# EasyEDA Pro project Batterytester.epro, schematic Schematic1
Board Name: Board1; Create Date: 2025-07-15; Page Name: P1; Project Name: @trent81; Schematic Name: Schematic1; Update Date: 2025-07-21; Company: EasyEDA.com; Page Size: A4; Version: V1.0
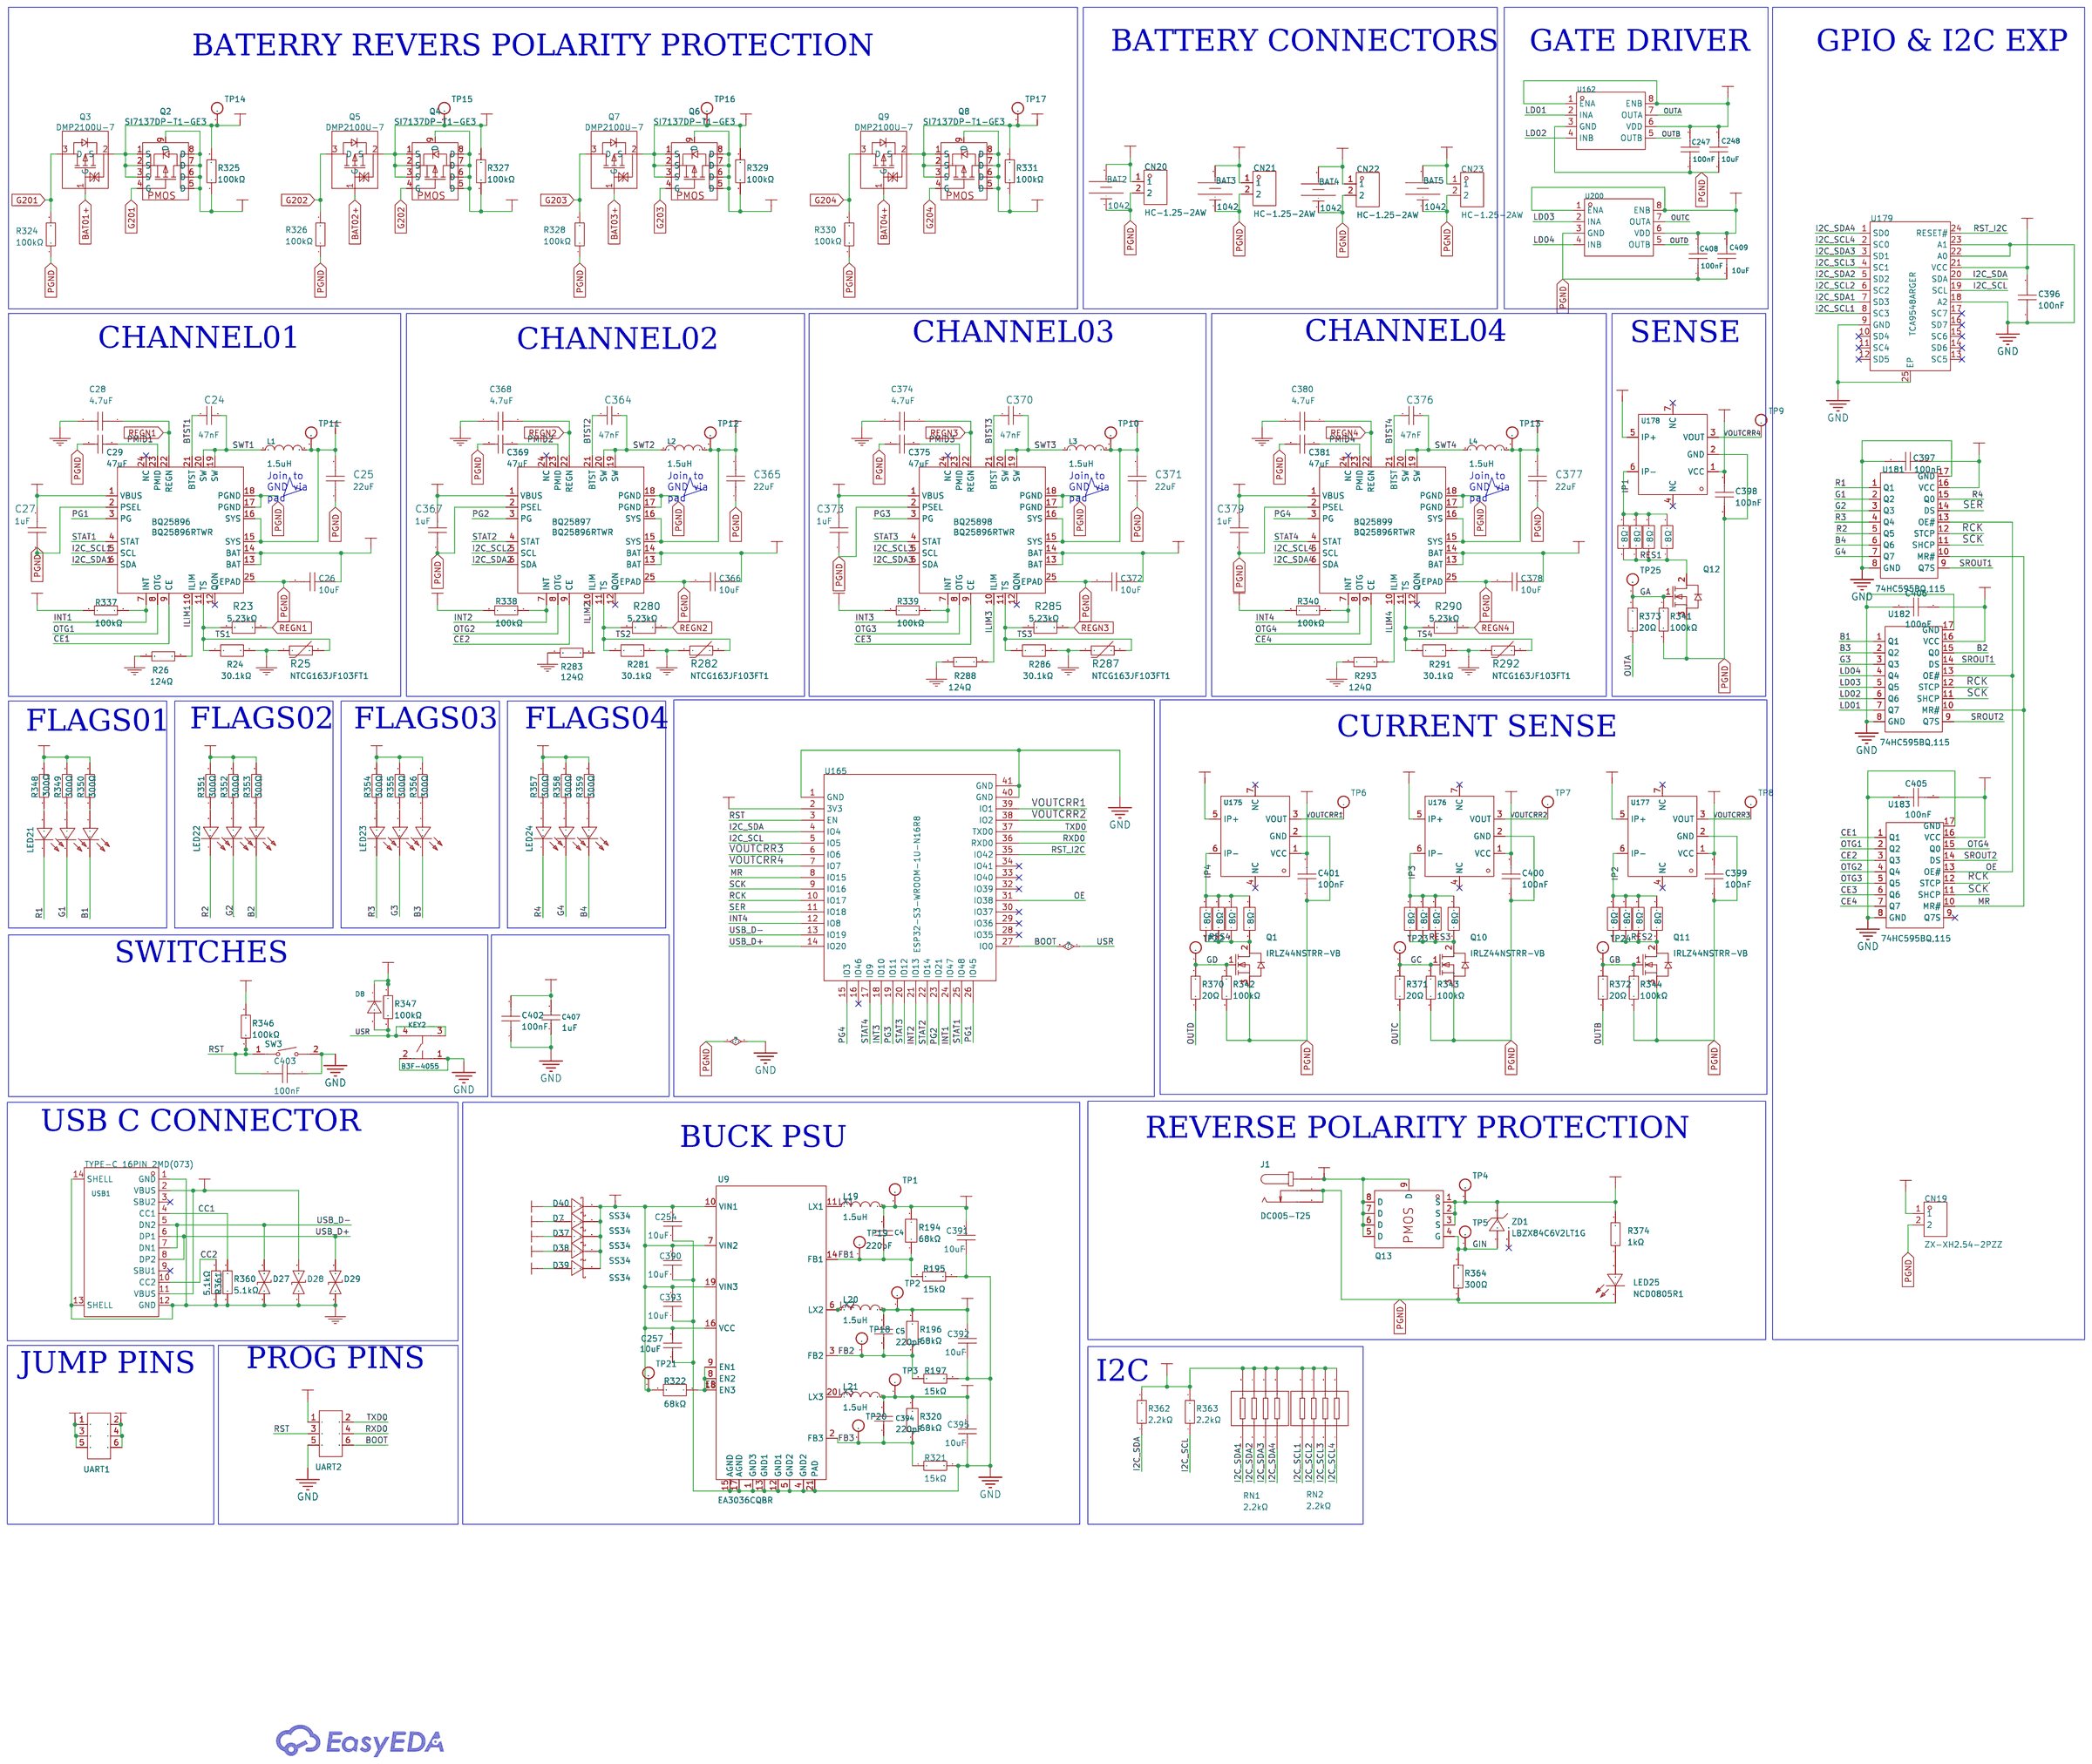
[diagram p0: schematic sheet]

## Parts
BAT2  1042  [BAT-SMD_1042P]
BAT3  1042  [BAT-SMD_1042P]
BAT4  1042  [BAT-SMD_1042P]
BAT5  1042  [BAT-SMD_1042P]
BQ25896  BQ25896RTWR  [QFN-24_L4.0-W4.0-P0.50-TL-EP2.7]
BQ25897  BQ25896RTWR  [QFN-24_L4.0-W4.0-P0.50-TL-EP2.7]
BQ25898  BQ25896RTWR  [QFN-24_L4.0-W4.0-P0.50-TL-EP2.7]
BQ25899  BQ25896RTWR  [QFN-24_L4.0-W4.0-P0.50-TL-EP2.7]
C4  220pF  [C1206]
C5  220pF  [C1206]
C24  47nF  [C0603]
C25  22uF  [C0603]
C26  10uF  [C0603]
C27  1uF  [C0603]
C28  4.7uF  [C0603]
C29  47uF  [C0805]
C247  100nF  [C1210]
C248  10uF  [C1210]
C254  10uF  [C1206]
C257  10uF  [C1206]
C364  47nF  [C0603]
C365  22uF  [C0603]
C366  10uF  [C0603]
C367  1uF  [C0603]
C368  4.7uF  [C0603]
C369  47uF  [C0805]
C370  47nF  [C0603]
C371  22uF  [C0603]
C372  10uF  [C0603]
C373  1uF  [C0603]
C374  4.7uF  [C0603]
C375  47uF  [C0805]
C376  47nF  [C0603]
C377  22uF  [C0603]
C378  10uF  [C0603]
C379  1uF  [C0603]
C380  4.7uF  [C0603]
C381  47uF  [C0805]
C390  10uF  [C1206]
C391  10uF  [C1206]
C392  10uF  [C1206]
C393  10uF  [C1206]
C394  220pF  [C1206]
C395  10uF  [C1206]
C396  100nF  [C0805]
C397  100nF  [C0805]
C398  100nF  [C0805]
C399  100nF  [C0805]
C400  100nF  [C0805]
C401  100nF  [C0805]
C402  100nF  [C0805]
C403  100nF  [C0805]
C405  100nF  [C0805]
C406  100nF  [C0805]
C407  1uF  [C0805]
C408  100nF  [C1210]
C409  10uF  [C1210]
CN19  ZX-XH2.54-2PZZ  [CONN-TH_2P-P2.50_HX25003-2A]
CN20  HC-1.25-2AW  [CONN-TH_2P-P1.25_HCTL_HC-1.25-2AW]
CN21  HC-1.25-2AW  [CONN-TH_2P-P1.25_HCTL_HC-1.25-2AW]
CN22  HC-1.25-2AW  [CONN-TH_2P-P1.25_HCTL_HC-1.25-2AW]
CN23  HC-1.25-2AW  [CONN-TH_2P-P1.25_HCTL_HC-1.25-2AW]
D7  SS34  [SMA_L4.3-W2.6-LS5.2-RD]
D8  1N4148W-7-F  [SOD-123_L2.7-W1.6-LS3.7-RD-1]
D27  LESD5D5.0CT1G  [SOD-523_L1.2-W0.8-LS1.6-BI]
D28  LESD5D5.0CT1G  [SOD-523_L1.2-W0.8-LS1.6-BI]
D29  LESD5D5.0CT1G  [SOD-523_L1.2-W0.8-LS1.6-BI]
D37  SS34  [SMA_L4.3-W2.6-LS5.2-RD]
D38  SS34  [SMA_L4.3-W2.6-LS5.2-RD]
D39  SS34  [SMA_L4.3-W2.6-LS5.2-RD]
D40  SS34  [SMA_L4.3-W2.6-LS5.2-RD]
J1  DC005-T25  [DC-IN-TH_DC-005-20A-1]
KEY2  B3F-4055  [KEY-TH_4P-L12.0-W12.0-P5.00-LS13.4-EH]
L1  1.5uH  [IND-SMD_L6.5-W6.5_VISHAY]
L2  1.5uH  [IND-SMD_L6.5-W6.5_VISHAY]
L3  1.5uH  [IND-SMD_L6.5-W6.5_VISHAY]
L4  1.5uH  [IND-SMD_L6.5-W6.5_VISHAY]
L19  1.5uH  [IND-SMD_L4.4-W4.2]
L20  1.5uH  [IND-SMD_L4.4-W4.2]
L21  1.5uH  [IND-SMD_L4.4-W4.2]
LED21  HL-AF-5060H271BU46FU79GC-S1-THL  [LED-ARRAY-SMD_6P-L5.4-W5.0-TL-FD]
LED22  HL-AF-5060H271BU46FU79GC-S1-THL  [LED-ARRAY-SMD_6P-L5.4-W5.0-TL-FD]
LED23  HL-AF-5060H271BU46FU79GC-S1-THL  [LED-ARRAY-SMD_6P-L5.4-W5.0-TL-FD]
LED24  HL-AF-5060H271BU46FU79GC-S1-THL  [LED-ARRAY-SMD_6P-L5.4-W5.0-TL-FD]
LED25  NCD0805R1  [LED0805-R-RD]
Q1  IRLZ44NSTRR-VB  [TO-263-3_L10.2-W9.2-P5.08-LS15.4-BR]
Q2  SI7137DP-T1-GE3  [DFN-8_L5.1-W5.7-P1.27-LS6.1-BL]
Q3  DMP2100U-7  [SOT-23_L2.9-W1.3-P1.90-LS2.4-BR]
Q4  SI7137DP-T1-GE3  [DFN-8_L5.1-W5.7-P1.27-LS6.1-BL]
Q5  DMP2100U-7  [SOT-23_L2.9-W1.3-P1.90-LS2.4-BR]
Q6  SI7137DP-T1-GE3  [DFN-8_L5.1-W5.7-P1.27-LS6.1-BL]
Q7  DMP2100U-7  [SOT-23_L2.9-W1.3-P1.90-LS2.4-BR]
Q8  SI7137DP-T1-GE3  [DFN-8_L5.1-W5.7-P1.27-LS6.1-BL]
Q9  DMP2100U-7  [SOT-23_L2.9-W1.3-P1.90-LS2.4-BR]
Q10  IRLZ44NSTRR-VB  [TO-263-3_L10.2-W9.2-P5.08-LS15.4-BR]
Q11  IRLZ44NSTRR-VB  [TO-263-3_L10.2-W9.2-P5.08-LS15.4-BR]
Q12  IRLZ44NSTRR-VB  [TO-263-3_L10.2-W9.2-P5.08-LS15.4-BR]
Q13  SI7137DP-T1-GE3  [DFN-8_L5.1-W5.7-P1.27-LS6.1-BL]
R23  5.23kΩ  [R0603]
R24  30.1kΩ  [R0603]
R25  NTCG163JF103FT1  [R0603]
R26  124Ω  [R0603]
R194  68kΩ  [R1206]
R195  15kΩ  [R1206]
R196  68kΩ  [R1206]
R197  15kΩ  [R1206]
R280  5.23kΩ  [R0603]
R281  30.1kΩ  [R0603]
R282  NTCG163JF103FT1  [R0603]
R283  124Ω  [R0603]
R285  5.23kΩ  [R0603]
R286  30.1kΩ  [R0603]
R287  NTCG163JF103FT1  [R0603]
R288  124Ω  [R0603]
R290  5.23kΩ  [R0603]
R291  30.1kΩ  [R0603]
R292  NTCG163JF103FT1  [R0603]
R293  124Ω  [R0603]
R320  68kΩ  [R1206]
R321  15kΩ  [R1206]
R322  68kΩ  [R1206]
R324  100kΩ  [R0805]
R325  100kΩ  [R0805]
R326  100kΩ  [R0805]
R327  100kΩ  [R0805]
R328  100kΩ  [R0805]
R329  100kΩ  [R0805]
R330  100kΩ  [R0805]
R331  100kΩ  [R0805]
R337  100kΩ  [R0805]
R338  100kΩ  [R0805]
R339  100kΩ  [R0805]
R340  100kΩ  [R0805]
R341  100kΩ  [R0805]
R342  100kΩ  [R0805]
R343  100kΩ  [R0805]
R344  100kΩ  [R0805]
R346  100kΩ  [R0805]
R347  100kΩ  [R0805]
R348  300Ω  [R0805]
R349  300Ω  [R0805]
R350  300Ω  [R0805]
R351  300Ω  [R0805]
R352  300Ω  [R0805]
R353  300Ω  [R0805]
R354  300Ω  [R0805]
R355  300Ω  [R0805]
R356  300Ω  [R0805]
R357  300Ω  [R0805]
R358  300Ω  [R0805]
R359  300Ω  [R0805]
R360  5.1kΩ  [R0805]
R361  5.1kΩ  [R0805]
R362  2.2kΩ  [R0805]
R363  2.2kΩ  [R0805]
R364  300Ω  [R0805]
R370  20Ω  [R1206]
R371  20Ω  [R1206]
R372  20Ω  [R1206]
R373  20Ω  [R1206]
R374  1kΩ  [R0805]
RN1  2.2kΩ  [RES-ARRAY-SMD_0603-8P-L3.2-W1.6-BL]
RN2  2.2kΩ  [RES-ARRAY-SMD_0603-8P-L3.2-W1.6-BL]
SW3  TS-3025-B-C-B  [SW-SMD_L3.0-W2.5-P3.40-LS4.0-L]
TP1  -  [TESTPOINT-SMD_BD2.0-H10.5]
TP2  -  [TESTPOINT-SMD_BD2.0-H10.5]
TP3  -  [TESTPOINT-SMD_BD2.0-H10.5]
TP4  -  [TESTPOINT-SMD_BD2.0-H10.5]
TP5  -  [TESTPOINT-SMD_BD2.0-H10.5]
TP6  -  [TESTPOINT-SMD_BD2.0-H10.5]
TP7  -  [TESTPOINT-SMD_BD2.0-H10.5]
TP8  -  [TESTPOINT-SMD_BD2.0-H10.5]
TP9  -  [TESTPOINT-SMD_BD2.0-H10.5]
TP10  -  [TESTPOINT-SMD_BD2.0-H10.5]
TP11  -  [TESTPOINT-SMD_BD2.0-H10.5]
TP12  -  [TESTPOINT-SMD_BD2.0-H10.5]
TP13  -  [TESTPOINT-SMD_BD2.0-H10.5]
TP14  -  [TESTPOINT-SMD_BD2.0-H10.5]
TP15  -  [TESTPOINT-SMD_BD2.0-H10.5]
TP16  -  [TESTPOINT-SMD_BD2.0-H10.5]
TP17  -  [TESTPOINT-SMD_BD2.0-H10.5]
TP18  -  [TESTPOINT-SMD_BD2.0-H10.5]
TP19  -  [TESTPOINT-SMD_BD2.0-H10.5]
TP20  -  [TESTPOINT-SMD_BD2.0-H10.5]
TP21  -  [TESTPOINT-SMD_BD2.0-H10.5]
TP22  -  [TESTPOINT-SMD_BD2.0-H10.5]
TP23  -  [TESTPOINT-SMD_BD2.0-H10.5]
TP24  -  [TESTPOINT-SMD_BD2.0-H10.5]
TP25  -  [TESTPOINT-SMD_BD2.0-H10.5]
U9  EA3036CQBR  [WQFN-20_L3.0-W3.0-P0.40-BL-EP]
U162  UCC27524ADR  [SOIC-8_L4.9-W3.9-P1.27-LS6.0-BL]
U165  ESP32-S3-WROOM-1U-N16R8  [WIRELM-SMD_ESP32-S3-WROOM-1U]
U175  ACS781LLRTR-100B-T  [PSOF-7_L6.4-W4.8-BL]
U176  ACS781LLRTR-100B-T  [PSOF-7_L6.4-W4.8-BL]
U177  ACS781LLRTR-100B-T  [PSOF-7_L6.4-W4.8-BL]
U178  ACS781LLRTR-100B-T  [PSOF-7_L6.4-W4.8-BL]
U179  TCA9548ARGER  [VQFN-24_L4.0-W4.0-P0.50-BL-EP2.5]
U181  74HC595BQ,115  [DHVQFN-16_L3.5-W2.5-P0.50-BL-EP]
U182  74HC595BQ,115  [DHVQFN-16_L3.5-W2.5-P0.50-BL-EP]
U183  74HC595BQ,115  [DHVQFN-16_L3.5-W2.5-P0.50-BL-EP]
U184  8Ω  [R1225]
U185  8Ω  [R1225]
U186  8Ω  [R1225]
U187  8Ω  [R1225]
U188  8Ω  [R1225]
U189  8Ω  [R1225]
U190  8Ω  [R1225]
U191  8Ω  [R1225]
U192  8Ω  [R1225]
U193  8Ω  [R1225]
U194  8Ω  [R1225]
U195  8Ω  [R1225]
U196  8Ω  [R1225]
U197  8Ω  [R1225]
U198  8Ω  [R1225]
U199  8Ω  [R1225]
U200  UCC27524ADR  [SOIC-8_L4.9-W3.9-P1.27-LS6.0-BL]
UART1  20021121-00006C4LF  [HDR-SMD_6P-P1.27-V-M-R2-C3-S1.27-LS5.5]
UART2  20021121-00006C4LF  [HDR-SMD_6P-P1.27-V-M-R2-C3-S1.27-LS5.5]
USB1  TYPE-C 16PIN 2MD(073)  [USB-C-SMD_TYPE-C-6PIN-2MD-073]
ZD1  LBZX84C6V2LT1G  [SOT-23-3_L2.9-W1.6-P1.90-LS2.8-BR]

## Library data of the parts
BAT2-BAT5 = 1042: Supplier Part: C5249310; Manufacturer: Keystone; JLCPCB Part Class: Extended Part; Datasheet: https://atta.szlcsc.com/upload/public/pdf/source/20220613/E20FB676785C04F2B410CFDFE9F9681E.pdf; Supplier: LCSC
BQ25896-BQ25899 = BQ25896RTWR: Supplier: LCSC; Supplier Part: C181475; Manufacturer: Texas Instruments; JLCPCB Part Class: Extended Part
C4 C5 C394 = CC1206KKX7RCBB221: Capacitance: Tolerance:±10% Tolerance:±10% Voltage Rated: Temperature Coefficient:; LCSC Part Name: 220pF ±10% 1kV; Supplier Part: C107193; Manufacturer: YAGEO(国巨); Supplier Footprint: 1206; JLCPCB Part Class: Extended Part; Datasheet: https://atta.szlcsc.com/upload/public/pdf/source/20180910/C282080_BCE296114B59C3710FB69343383A5C6E.pdf; Supplier: LCSC; Tolerance: ±10%
C24 C364 C370 C376 = CL10B473JB8NNNC: Capacitance: Tolerance:±5% Tolerance:±5% Voltage Rated: Temperature Coefficient:; LCSC Part Name: 47nF ±5% 50V; Supplier Part: C444880; Manufacturer: SAMSUNG(三星); Supplier Footprint: 0603; JLCPCB Part Class: Extended Part; Datasheet: https://atta.szlcsc.com/upload/public/pdf/source/20191106/C444885_D1DE823F0ED498E02883F0194C396E9C.pdf; Supplier: LCSC; Tolerance: ±5%
C25 C365 C371 C377 = GRM188R61A226ME15D: Capacitance: Tolerance:±20% Tolerance:±20% Voltage Rated: Temperature Coefficient:; LCSC Part Name: 22uF ±20% 10V; Supplier Part: C84419; Manufacturer: muRata(村田); Supplier Footprint: 0603; JLCPCB Part Class: Extended Part; Datasheet: https://atta.szlcsc.com/upload/public/pdf/source/20161024/1477288637384.pdf; Supplier: LCSC; Tolerance: ±20%
C26 C366 C372 C378 = GRM188Z71A106KA73D: Capacitance: Tolerance:±10% Tolerance:±10% Voltage Rated: Temperature Coefficient:; LCSC Part Name: 10uF ±10% 10V; Supplier Part: C2959727; Manufacturer: muRata(村田); Supplier Footprint: 0603; JLCPCB Part Class: Extended Part; Datasheet: https://atta.szlcsc.com/upload/public/pdf/source/20220328/6A4892B7E841253269A84FFE395E0578.pdf; Supplier: LCSC; Tolerance: ±10%
C27 C367 C373 C379 = CGA3E1X7R1V105KT000N: Capacitance: Tolerance:±10% Tolerance:±10% Voltage Rated: Temperature Coefficient:; LCSC Part Name: 1uF ±10% 35V; Supplier Part: C342956; Manufacturer: TDK; Supplier Footprint: 0603; JLCPCB Part Class: Extended Part; Datasheet: https://atta.szlcsc.com/upload/public/pdf/source/20190410/C342987_3963516CFC6D3522CA0E150D06ECDE07.pdf; Supplier: LCSC; Tolerance: ±10%
C28 C368 C374 C380 = GRM188Z71C475KE21D: Capacitance: Tolerance:±10% Tolerance:±10% Voltage Rated: Temperature Coefficient:; LCSC Part Name: 4.7uF ±10% 16V; Supplier Part: C389010; Manufacturer: muRata(村田); Supplier Footprint: 0603; JLCPCB Part Class: Extended Part; Datasheet: https://atta.szlcsc.com/upload/public/pdf/source/20190418/C389010_378994D96815F6C3A9D8A85630794D48.pdf; Supplier: LCSC; Tolerance: ±10%
C29 C369 C375 C381 = C2012X5R1A476MTJ00E: Capacitance: Tolerance:±20% Tolerance:±20% Voltage Rated: Temperature Coefficient:; LCSC Part Name: 47uF ±20% 10V; Supplier Part: C76636; Manufacturer: TDK; Supplier Footprint: 0805; JLCPCB Part Class: Extended Part; Datasheet: https://atta.szlcsc.com/upload/public/pdf/source/20230606/A83975C7E70EF5AFCD4A17254ABD78F2.pdf; Supplier: LCSC; Tolerance: ±20%
C247 C408 = 1210B104K631NT: Capacitance:100nF Tolerance:±10% Tolerance:±10% Voltage Rating:630V Temperature Coefficient:X7R; LCSC Part Name: 100nF ±10% 630V; Supplier Part: C1322392; Manufacturer: FH(风华); Supplier Footprint: 1210; JLCPCB Part Class: Extended Part; Datasheet: https://atta.szlcsc.com/upload/public/pdf/source/20200305/C486355_26A10D38EF8C2A5C37091D0039909270.pdf; Supplier: LCSC; Tolerance: ±10%; Voltage Rating: 630V; Temperature Coefficient: X7R
C248 C409 = CL32B106KBJNNNE: Capacitance: Tolerance:±10% Tolerance:±10% Voltage Rated: Temperature Coefficient:; LCSC Part Name: 10uF ±10% 50V; Supplier Part: C138687; Manufacturer: SAMSUNG(三星); Supplier Footprint: 1210; JLCPCB Part Class: Extended Part; Datasheet: https://atta.szlcsc.com/upload/public/pdf/source/20190426/C138687_F326FA7378191C6A10A83DC717674AAD.pdf; Supplier: LCSC; Tolerance: ±10%
C254 C257 C390-C393 C395 = CL31A106KBHNNNE: Capacitance: Tolerance:±10% Tolerance:±10% Voltage Rated: Temperature Coefficient:; LCSC Part Name: 10uF ±10% 50V; Supplier Part: C13585; Manufacturer: SAMSUNG(三星); Supplier Footprint: 1206; JLCPCB Part Class: Basic Part; Datasheet: https://atta.szlcsc.com/upload/public/pdf/source/20160218/1457707763339.pdf; Supplier: LCSC; Tolerance: ±10%
C396-C403 C405 C406 = CC0805KRX7R9BB104: Capacitance: Tolerance:±10% Tolerance:±10% Voltage Rated: Temperature Coefficient:; LCSC Part Name: 100nF ±10% 50V; Supplier Part: C49678; Manufacturer: YAGEO(国巨); Supplier Footprint: 0805; JLCPCB Part Class: Basic Part; Datasheet: https://atta.szlcsc.com/upload/public/pdf/source/20180224/C181747_15194369449651363981.pdf; Supplier: LCSC; Tolerance: ±10%
C407 = CL21B105KBFNNNE: Capacitance: Tolerance:±10% Tolerance:±10% Voltage Rated: Temperature Coefficient:; LCSC Part Name: 1uF ±10% 50V; Supplier Part: C28323; Manufacturer: SAMSUNG(三星); Supplier Footprint: 0805; JLCPCB Part Class: Basic Part; Datasheet: https://atta.szlcsc.com/upload/public/pdf/source/20160218/1457707763339.pdf; Supplier: LCSC; Tolerance: ±10%
CN19 = ZX-XH2.54-2PZZ: Pins Structure:1x2P Pitch:2.54mm Mounting Style:Straight Reference Series:XH Number of Pins:2P Number of Rows:1 Number of PINs Per Row:2 Row Spacing:- Current Rating (Max):3A Contact Material:Brass Contact Plating:Tin Operating Temperature Range:-25℃~+85℃; Supplier Part: C7429632; Manufacturer: Megastar(兆星); Supplier Footprint: 插件,P=2.54mm; JLCPCB Part Class: Extended Part; Datasheet: https://atta.szlcsc.com/upload/public/pdf/source/20230619/19BA6947230AA44A04D3EDD65E618FD0.pdf; Supplier: LCSC; Pins Structure: 1x2P; Pitch: 2.54mm; Mounting Style: Straight; Reference Series: XH; Number of Pins: 2P; Number of Rows: 1; Number of PINs Per Row: 2; Current Rating (Max): 3A; Contact Material: Brass; Contact Plating: Tin; Operating Temperature Range: -25℃~+85℃
CN20-CN23 = HC-1.25-2AW: Pins Structure:1x2P Pitch:1.25mm Mounting Style:Bend insert Reference Series:PicoBlade(MX 1.25) Number of Pins:2P Number of Rows:1 Number of PINs Per Row:2 Row Spacing:- Current Rating (Max):1A Contact Material:Brass Contact Plating:Tin Operating Temperat; LCSC Part Name: 1x2P 间距:1.25mm 弯插 系列:PicoBlade(MX 1.25); Supplier Part: C2845535; Manufacturer: HCTL(华灿天禄); Supplier Footprint: 弯插,P=1.25mm; JLCPCB Part Class: Extended Part; Datasheet: https://atta.szlcsc.com/upload/public/pdf/source/20230707/04F6BEA69F699E7BB6558EF06AF1DC24.pdf; Supplier: LCSC; Pins Structure: 1x2P; Pitch: 1.25mm; Mounting Style: Bend insert; Reference Series: PicoBlade(MX 1.25); Number of Pins: 2P; Number of Rows: 1; Number of PINs Per Row: 2; Current Rating (Max): 1A; Contact Material: Brass; Contact Plating: Tin; Operating Temperature Range: -25℃~+85℃; Rated Voltage (Max): 125V; Plastic Material: PA46; Flame Retardant Rating: UL94V-0; Z-Height of the Board: 3.2mm; X-Length of Bottom Edge on Board (Spacing Line): 4.25mm; Y-Width of Bottom Edge on Board: 4.7mm
D7 D37-D40 = SS34_C8678: Diode Configuration:Independent Type Forward Voltage (Vf@If):550mV@3A Reverse Voltage (Vr):40V Rectified Current:3A Reverse Leakage Current (Ir):500uA@40V; LCSC Part Name: 电压:40V 电流:3A; Supplier Part: C8678; Manufacturer: MDD(辰达半导体); Supplier Footprint: SMA(DO-214AC); JLCPCB Part Class: Basic Part; Datasheet: https://atta.szlcsc.com/upload/public/pdf/source/20240710/2118BB86FDDB2E0B294389AC1F3F65C8.pdf; Supplier: LCSC; Diode Configuration: Independent Type; Forward Voltage (Vf@If): 550mV@3A; Reverse Voltage (Vr): 40V; Rectified Current: 3A; Reverse Leakage Current (Ir): 500uA@40V
D8 = 1N4148W-7-F: Diode Configuration: Forward Voltage (Vf@If):1.25V@150mA Reverse Voltage (Vr): Average Rectified Current (Io): Power Dissipation: Reverse Leakage Current:1uA@75V Reverse Recovery Time (trr): Operating Temperature:-65℃~+150℃@(Tj) Operating Temperature:-65℃; LCSC Part Name: 电压:100V 电流:300mA; Supplier Part: C83528; Manufacturer: DIODES(美台); Supplier Footprint: SOD-123; JLCPCB Part Class: Extended Part; Datasheet: https://atta.szlcsc.com/upload/public/pdf/source/20161024/1477288538619.pdf; Supplier: LCSC; Forward Voltage (Vf@If): 1.25V@150mA; Reverse Leakage Current: 1uA@75V; Operating Temperature: -65℃~+150℃@(Tj)
D27-D29 = LESD5D5.0CT1G_C41399463: LCSC Part Name: 双向 5V截止 7A峰值脉冲; Supplier Part: C41399463; Manufacturer: GOODWORK(固得沃克); Supplier Footprint: SOD-523; Datasheet: https://atta.szlcsc.com/upload/public/pdf/source/20240930/3DBB69F9DFF750B46374C05084BE62EF.pdf; Supplier: LCSC
J1 = DC005-T25: Connector Type:DC Power Receptacle Mounting Type:Bend-in Inside Contact Diameter:2.5mm Outside Contact Diameter:6.3mm Current Rating:3A Voltage Rating (Max):12V Operating Temperature:-10℃~+60℃ Operating Temperature:-10℃~+60℃; LCSC Part Name: DC电源插座 内径:2.5mm 外径:6.3mm; Supplier Part: C111573; Manufacturer: SOFNG(硕方); Supplier Footprint: 插件; JLCPCB Part Class: Extended Part; Datasheet: https://atta.szlcsc.com/upload/public/pdf/source/20211217/AAF92010038535095742900872F779AE.pdf; Supplier: LCSC; Connector Type: DC Power Receptacle; Mounting Type: Bend-in; Inside Contact Diameter: 2.5mm; Outside Contact Diameter: 6.3mm; Current Rating: 3A; Voltage Rating (Max): 12V; Operating Temperature: -10℃~+60℃
KEY2 = B3F-4055_C84931: Circuit:SPST Actuator Style:Rectangle button Mounting Style:Direct Insert Switch Length:12mm Switch Width:12mm Switch Height:7.3mm Contact Current:50mA Voltage Rating (DC):24V With Lamp:- Mechanical Life:-; LCSC Part Name: 12*12*7.3mm 直插 轻触开关; Supplier Part: C84931; Manufacturer: OMRON(欧姆龙); Supplier Footprint: 插件; JLCPCB Part Class: Extended Part; Datasheet: https://atta.szlcsc.com/upload/public/pdf/source/20170810/C93157_1502335414592880008.pdf; Supplier: LCSC; Circuit: SPST; Actuator Style: Rectangle button; Mounting Style: Direct Insert; Switch Length: 12mm; Switch Width: 12mm; Switch Height: 7.3mm; Contact Current: 50mA; Voltage Rating (DC): 24V
L1-L4 = IHLP2525CZER1R5M01: Inductance: Tolerance:±20% Tolerance:±20% Rated Current: Saturation Current (Isat):18A DC Resistance (DCR): Ratings:-; LCSC Part Name: 1.5uH ±20% 18A; Supplier Part: C845020; Manufacturer: VISHAY(威世); Supplier Footprint: SMD,6.5x6.9mm; JLCPCB Part Class: Extended Part; Datasheet: https://atta.szlcsc.com/upload/public/pdf/source/20211116/476D9E4F649FFADE3C992F1E036BD265.pdf; Supplier: LCSC; Tolerance: ±20%; Saturation Current (Isat): 18A
L19-L21 = FXL0420-1R5-M: Inductance: Tolerance:±20% Tolerance:±20% Rated Current: Saturation Current (Isat):6A DC Resistance (DCR): Type:Integrated molded inductor; LCSC Part Name: 1.5uH ±20% 6A; Supplier Part: C167205; Manufacturer: cjiang(长江微电); Supplier Footprint: SMD,4.2x4.4mm; JLCPCB Part Class: Extended Part; Datasheet: https://atta.szlcsc.com/upload/public/pdf/source/20240426/3189EA8206330E2108542F9E34E540E7.pdf; Supplier: LCSC; Tolerance: ±20%; Saturation Current (Isat): 6A; Type: Integrated molded inductor
LED21-LED24 = HL-AF-5060H271BU46FU79GC-S1-THL: Supplier Part: C219409; Manufacturer: HONGLITRONIC(鸿利光电); Supplier Footprint: SMD5050; JLCPCB Part Class: Extended Part; Datasheet: https://atta.szlcsc.com/upload/public/pdf/source/20180503/C219409_0CFE42153F672A4C05B1C40D14E85291.pdf; Supplier: LCSC
LED25 = NCD0805R1_C84256: Lamp Holder Type:- Emitted Color:Red Forward Voltage (VF):1.6V~2.6V Forward Voltage (VF):1.6V~2.6V Power Dissipation:65mW Forward Current:20mA Dominant Wavelength:615nm~630nm Dominant Wavelength:615nm~630nm Peak Wavelength:- Diode Configuration:独立二极管 Lens; Supplier Part: C84256; Manufacturer: 国星光电; Supplier Footprint: 0805; JLCPCB Part Class: Basic Part; Datasheet: https://atta.szlcsc.com/upload/public/pdf/source/20200820/C84256_F0A75A43B3EAD75808600A0514C76B99.pdf; Supplier: LCSC; Emitted Color: Red; Forward Voltage (VF): 1.6V~2.6V; Power Dissipation: 65mW; Forward Current: 20mA; Dominant Wavelength: 615nm~630nm; Diode Configuration: 独立二极管; Lens Color: 无色透明透镜; Luminous Intensity: 67mcd~195mcd; Viewing Angle: 130°; Operating Temperature: -30℃~+85℃
Q1 Q10-Q12 = IRLZ44NSTRR-VB: Drain to Source Voltage:60V Current - Continuous Drain(Id): RDS(on):11mΩ@10V,75A Pd - Power Dissipation:136W Gate Threshold Voltage (Vgs(th)@Id):3V Gate Charge(Qg):47nC@10V Input Capacitance(Ciss@Vds):4.3nF@25V Reverse Transfer Capacitance (Crss@Vds):225p; LCSC Part Name: N沟道,电流:75A,耐压:60V; Supplier Part: C2680878; Manufacturer: VBsemi(微碧半导体); Supplier Footprint: TO-263; JLCPCB Part Class: Extended Part; Datasheet: https://atta.szlcsc.com/upload/public/pdf/source/20240814/20B6605BBA769C8470073FCF127173C6.pdf; Supplier: LCSC; Drain to Source Voltage: 60V; RDS(on): 11mΩ@10V,75A; Pd - Power Dissipation: 136W; Gate Threshold Voltage (Vgs(th)@Id): 3V; Gate Charge(Qg): 47nC@10V; Input Capacitance(Ciss@Vds): 4.3nF@25V; Reverse Transfer Capacitance (Crss@Vds): 225pF@25V; Operating Temperature: -55℃~+175℃
Q2 Q4 Q6 Q8 = SI7137DP-T1-GE3: Supplier: LCSC; Supplier Part: C784367; Manufacturer: VISHAY(威世); JLCPCB Part Class: Extended Part
Q3 Q5 Q7 Q9 = DMP2100U-7: Supplier: LCSC; Manufacturer: DIODES; Supplier Part: C154867; JLCPCB Part Class: Extended Part
Q13 = SI7137DP-T1-GE3: Type:1 Piece P-Channel Drain Source Voltage (Vdss):20V Continuous Drain Current (Id): Drain Source On Resistance (RDS(on)@Vgs,Id):0.00195Ω@10V Power Dissipation (Pd): Gate Threshold Voltage (Vgs(th)@Id):500mV@250uA Total Gate Charge (Qg@Vgs):188nC Input C; LCSC Part Name: 1个P沟道 耐压:20V 电流:42A; Supplier Part: C784367; Manufacturer: VISHAY(威世); Supplier Footprint: SOP-8; JLCPCB Part Class: Extended Part; Datasheet: https://atta.szlcsc.com/upload/public/pdf/source/20200917/C784367_90CFBD78C21EC8C65E334872855C2BD0.pdf; Supplier: LCSC; Type: 1 Piece P-Channel; Drain Source Voltage (Vdss): 20V; Drain Source On Resistance (RDS(on)@Vgs,Id): 0.00195Ω@10V; Gate Threshold Voltage (Vgs(th)@Id): 500mV@250uA; Total Gate Charge (Qg@Vgs): 188nC; Input Capacitance (Ciss@Vds): 20000pF; Reverse Transfer Capacitance (Crss@Vds): 390pF; Operating Temperature: -55℃~+150℃
R23 R280 R285 R290 = ERJ3EKF5231V: Type:Thick Film Resistors Resistance:5.23kΩ Tolerance:±1% Tolerance:±1% Power(Watts): Overload Voltage (Max):- Temperature Coefficient:±100ppm/℃ Temperature Coefficient:±100ppm/℃ Operating Temperature Range:-55℃~+155℃ Operating Temperature Range:-55℃~+155; LCSC Part Name: 5.23kΩ ±1% 100mW 厚膜电阻; Supplier Part: C403263; Manufacturer: PANASONIC(松下); Supplier Footprint: 0603; JLCPCB Part Class: Extended Part; Datasheet: https://atta.szlcsc.com/upload/public/pdf/source/20190709/C403410_4AA7B6683950D876CE9308C181828FCD.pdf; Supplier: LCSC; Type: Thick Film Resistors; Tolerance: ±1%; Temperature Coefficient: ±100ppm/℃; Operating Temperature Range: -55℃~+155℃
R24 R281 R286 R291 = CRCW060330K1FKEA: Type:Thick Film Resistors Resistance: Tolerance:±1% Tolerance:±1% Power(Watts): Overload Voltage (Max): Temperature Coefficient:±100ppm/℃ Temperature Coefficient:±100ppm/℃ Operating Temperature Range:-55℃~+155℃ Operating Temperature Range:-55℃~+155℃; LCSC Part Name: 厚膜电阻 30.1kΩ ±1% 100mW; Supplier Part: C844775; Manufacturer: VISHAY(威世); Supplier Footprint: 0603; JLCPCB Part Class: Extended Part; Datasheet: https://atta.szlcsc.com/upload/public/pdf/source/20200922/C242478_0C7172CD6F5C3D507069694ED76193BB.pdf; Supplier: LCSC; Type: Thick Film Resistors; Tolerance: ±1%; Temperature Coefficient: ±100ppm/℃; Operating Temperature Range: -55℃~+155℃
R25 R282 R287 R292 = NTCG163JF103FT1: Resistance @ 25℃: B Constant (25℃/50℃): Resistance Tolerance: B Constant (25℃/75℃):3422K B Constant (25℃/85℃):3435K B Constant (25℃/100℃):3435K Power: B Constant Tolerance: Steady State Current (Max):310uA Operating Temperature:-40℃~+125℃ Operating Temper; LCSC Part Name: 10kΩ 电阻精度:±1% 3380K; Supplier Part: C76589; Manufacturer: TDK; Supplier Footprint: 0603; JLCPCB Part Class: Extended Part; Datasheet: https://atta.szlcsc.com/upload/public/pdf/source/20180420/C189881_93225366783E89160088C2F92B447DFF.pdf; Supplier: LCSC; B Constant (25℃/75℃): 3422K; B Constant (25℃/85℃): 3435K; B Constant (25℃/100℃): 3435K; Steady State Current (Max): 310uA; Operating Temperature: -40℃~+125℃
R26 R283 R288 R293 = RK73H1JTTD1240F: Type:Thick Film Resistors Resistance: Tolerance:±1% Tolerance:±1% Power(Watts): Overload Voltage (Max): Temperature Coefficient:±100ppm/℃ Temperature Coefficient:±100ppm/℃ Operating Temperature Range:-55℃~+155℃ Operating Temperature Range:-55℃~+155℃; LCSC Part Name: 厚膜电阻 124Ω ±1% 125mW; Supplier Part: C317096; Manufacturer: KOA; Supplier Footprint: 0603; JLCPCB Part Class: Extended Part; Datasheet: https://atta.szlcsc.com/upload/public/pdf/source/20190124/C346150_30B9D586AD5A22FDBA3A30D88744B479.pdf; Supplier: LCSC; Type: Thick Film Resistors; Tolerance: ±1%; Temperature Coefficient: ±100ppm/℃; Operating Temperature Range: -55℃~+155℃
R194 R196 R320 R322 = RT1206BRD0768KL: Type:Thin Film Resistor Resistance: Tolerance:±0.1% Tolerance:±0.1% Power(Watts):250mW Overload Voltage (Max): Temperature Coefficient:±25ppm/℃ Temperature Coefficient:±25ppm/℃ Operating Temperature Range:-55℃~+155℃ Operating Temperature Range:-55℃~+155℃; LCSC Part Name: 薄膜电阻 68kΩ ±0.1% 250mW; Supplier Part: C706422; Manufacturer: YAGEO(国巨); Supplier Footprint: 1206; JLCPCB Part Class: Extended Part; Datasheet: https://atta.szlcsc.com/upload/public/pdf/source/20200720/C706422_759B829B0D18A4900E8B43DA140C33CB.pdf; Supplier: LCSC; Type: Thin Film Resistor; Tolerance: ±0.1%; Power(Watts): 250mW; Temperature Coefficient: ±25ppm/℃; Operating Temperature Range: -55℃~+155℃
R195 R197 R321 = AR06BTCV1502: Type:Thin Film Resistor Resistance: Tolerance:±0.1% Tolerance:±0.1% Power(Watts): Overload Voltage (Max): Temperature Coefficient:±25ppm/℃ Temperature Coefficient:±25ppm/℃ Operating Temperature Range:-55℃~+155℃ Operating Temperature Range:-55℃~+155℃; LCSC Part Name: 薄膜电阻 15kΩ ±0.1% 125mW; Supplier Part: C319850; Manufacturer: Viking(光颉); Supplier Footprint: 1206; JLCPCB Part Class: Extended Part; Datasheet: https://atta.szlcsc.com/upload/public/pdf/source/20191129/C465721_10D49275DB41E427863CE9C8D788770A.pdf; Supplier: LCSC; Type: Thin Film Resistor; Tolerance: ±0.1%; Temperature Coefficient: ±25ppm/℃; Operating Temperature Range: -55℃~+155℃
R324-R331 R337-R344 R346 R347 = RT0805BRD07100KL: Type:Thin Film Resistor Resistance: Tolerance:±0.1% Tolerance:±0.1% Power(Watts): Overload Voltage (Max): Temperature Coefficient:±25ppm/℃ Temperature Coefficient:±25ppm/℃ Operating Temperature Range:-55℃~+155℃ Operating Temperature Range:-55℃~+155℃; LCSC Part Name: 薄膜电阻 100kΩ ±0.1% 125mW; Supplier Part: C122537; Manufacturer: YAGEO(国巨); Supplier Footprint: 0805; JLCPCB Part Class: Extended Part; Datasheet: https://atta.szlcsc.com/upload/public/pdf/source/20170721/C122537_1500619325668834091.pdf; Supplier: LCSC; Type: Thin Film Resistor; Tolerance: ±0.1%; Temperature Coefficient: ±25ppm/℃; Operating Temperature Range: -55℃~+155℃
R348-R359 R364 = PTFR0805B300RN9: Type:Thin Film Resistor Resistance:300Ω Tolerance:±0.1% Tolerance:±0.1% Power(Watts):130mW Voltage-Supply(Max):150V Temperature Coefficient:±10ppm/℃ Temperature Coefficient:±10ppm/℃ Operating Temperature:-55℃~+125℃ Operating Temperature:-55℃~+125℃; LCSC Part Name: 薄膜电阻 300Ω ±0.1% 130mW; Supplier Part: C351581; Manufacturer: RESI(开步睿思); Supplier Footprint: 0805; JLCPCB Part Class: Extended Part; Datasheet: https://atta.szlcsc.com/upload/public/pdf/source/20240506/11BDC7478D84177AC2A5326A65B6EB29.pdf; Supplier: LCSC; Type: Thin Film Resistor; Tolerance: ±0.1%; Power(Watts): 130mW; Voltage-Supply(Max): 150V; Temperature Coefficient: ±10ppm/℃; Operating Temperature: -55℃~+125℃
R360 R361 = RT0805BRD075K1L: Type:Thin Film Resistor Resistance: Tolerance:±0.1% Tolerance:±0.1% Power(Watts): Overload Voltage (Max): Temperature Coefficient:±25ppm/℃ Temperature Coefficient:±25ppm/℃ Operating Temperature Range:-55℃~+155℃ Operating Temperature Range:-55℃~+155℃; LCSC Part Name: 薄膜电阻 5.1kΩ ±0.1% 125mW; Supplier Part: C122968; Manufacturer: YAGEO(国巨); Supplier Footprint: 0805; JLCPCB Part Class: Extended Part; Datasheet: https://atta.szlcsc.com/upload/public/pdf/source/20170728/C122968_1501225760866848819.pdf; Supplier: LCSC; Type: Thin Film Resistor; Tolerance: ±0.1%; Temperature Coefficient: ±25ppm/℃; Operating Temperature Range: -55℃~+155℃
R362 R363 = PTFR0805B2K20N9: Type:Thin Film Resistor Resistance:2.2kΩ Tolerance:±0.1% Tolerance:±0.1% Power(Watts):130mW Voltage-Supply(Max):150V Temperature Coefficient:±10ppm/℃ Temperature Coefficient:±10ppm/℃ Operating Temperature:-55℃~+125℃ Operating Temperature:-55℃~+125℃; LCSC Part Name: 薄膜电阻 2.2kΩ ±0.1% 130mW; Supplier Part: C351585; Manufacturer: RESI(开步睿思); Supplier Footprint: 0805; JLCPCB Part Class: Extended Part; Datasheet: https://atta.szlcsc.com/upload/public/pdf/source/20240506/11BDC7478D84177AC2A5326A65B6EB29.pdf; Supplier: LCSC; Type: Thin Film Resistor; Tolerance: ±0.1%; Power(Watts): 130mW; Voltage-Supply(Max): 150V; Temperature Coefficient: ±10ppm/℃; Operating Temperature: -55℃~+125℃
R370-R373 = RC1206FR-0720RL: Type:Thick Film Resistors Resistance: Tolerance:±1% Tolerance:±1% Power(Watts):250mW Overload Voltage (Max): Temperature Coefficient:±100ppm/℃ Temperature Coefficient:±100ppm/℃ Operating Temperature Range:-55℃~+155℃ Operating Temperature Range:-55℃~+155℃; LCSC Part Name: 厚膜电阻 20Ω ±1% 250mW; Supplier Part: C114941; Manufacturer: YAGEO(国巨); Supplier Footprint: 1206; JLCPCB Part Class: Extended Part; Datasheet: https://atta.szlcsc.com/upload/public/pdf/source/20180821/C275644_0D56F95EFF785E7D9A1FEF436B37DA78.pdf; Supplier: LCSC; Type: Thick Film Resistors; Tolerance: ±1%; Power(Watts): 250mW; Temperature Coefficient: ±100ppm/℃; Operating Temperature Range: -55℃~+155℃
R374 = 0805W8F1001T5E: Type:Thick Film Resistors Resistance:1kΩ Tolerance:±1% Tolerance:±1% Power(Watts): Overload Voltage (Max): Temperature Coefficient:±100ppm/℃ Temperature Coefficient:±100ppm/℃ Operating Temperature Range:-55℃~+155℃ Operating Temperature Range:-55℃~+155℃; LCSC Part Name: 1kΩ ±1% 125mW 厚膜电阻; Supplier Part: C17513; Manufacturer: UNI-ROYAL(厚声); Supplier Footprint: 0805; JLCPCB Part Class: Basic Part; Datasheet: https://atta.szlcsc.com/upload/public/pdf/source/20200306/C422600_1E6D84923E4A46A82E41ADD87F860B5C.pdf; Supplier: LCSC; Type: Thick Film Resistors; Tolerance: ±1%; Temperature Coefficient: ±100ppm/℃; Operating Temperature Range: -55℃~+155℃
RN1 RN2 = 4D03WGJ0222T5E: Number of Resistors: Resistance:2.2kΩ Tolerance:±5% Tolerance:±5% Power(Watts): Temperature Coefficient:±200ppm/℃ Temperature Coefficient:±200ppm/℃ Number of Pins:; LCSC Part Name: 2.2kΩ ±5%; Supplier Part: C12001; Manufacturer: UNI-ROYAL(厚声); Supplier Footprint: 0603x4; JLCPCB Part Class: Extended Part; Datasheet: https://atta.szlcsc.com/upload/public/pdf/source/20191224/C474318_2527498AE30E813171187CCD28401A71.pdf; Supplier: LCSC; Tolerance: ±5%; Temperature Coefficient: ±200ppm/℃
SW3 = TS-3025-B-C-B: Circuit:SPST Actuator Style:Round Button Operating Force:160gf Mounting Style:Brick nogging Switch Length:2.5mm Switch Width:3mm Switch Height:1.7mm Strike Gundam:不带 Contact Current:50mA Voltage Rating (DC):12V Insulation Resistance:- Actuator/Cap Color:B; LCSC Part Name: 2.5*3*1.7mm 立贴 轻触开关; Supplier Part: C2689695; Manufacturer: XKB Connectivity(中国星坤); Supplier Footprint: SMD; JLCPCB Part Class: Extended Part; Datasheet: https://atta.szlcsc.com/upload/public/pdf/source/20210202/C2689695_C8C88EF9FAE34D6A45B2B13281CA2BF9.pdf; Supplier: LCSC; Circuit: SPST; Actuator Style: Round Button; Operating Force: 160gf; Mounting Style: Brick nogging; Switch Length: 2.5mm; Switch Width: 3mm; Switch Height: 1.7mm; Strike Gundam: 不带; Contact Current: 50mA; Voltage Rating (DC): 12V; Actuator/Cap Color: Black; With Lamp: No; Mechanical Life: 10万次; Operating Temperature: -30℃~+85℃
TP1-TP25 = TESTPOINT
U9 = EA3036CQBR: LCSC Part Name: EA3036; Supplier Part: C570857; Manufacturer: everanalog(申风); Supplier Footprint: WQFN-20-EP(3x3); JLCPCB Part Class: Extended Part; Datasheet: https://atta.szlcsc.com/upload/public/pdf/source/20200529/C570857_65255DA4FBC4C795D9FF4AFE8A3669F7.pdf; Supplier: LCSC
U162 U200 = UCC27524ADR: Driven Configuration:Low edge Load Type:IGBT；MOSFET Number of Drivers:2 Current - Output Low(IOL):5A Current - Output High(IOH):5A Voltage - Supply:4.5V~18V Voltage - Supply:4.5V~18V Rise Time:7ns Fall Time:9ns Operating Temperature:-40℃~+140℃ Operating T; Supplier Part: C185857; Manufacturer: TI(德州仪器); Supplier Footprint: SOIC-8; JLCPCB Part Class: Extended Part; Datasheet: https://www.ti.com/cn/lit/gpn/ucc27524a; Supplier: LCSC; Driven Configuration: Low edge; Load Type: IGBT；MOSFET; Number of Drivers: 2; Current - Output Low(IOL): 5A; Current - Output High(IOH): 5A; Voltage - Supply: 4.5V~18V; Rise Time: 7ns; Fall Time: 9ns; Operating Temperature: -40℃~+140℃
U165 = ESP32-S3-WROOM-1U-N16R8: Supplier Part: C3013946; Manufacturer: ESPRESSIF(乐鑫); Supplier Footprint: SMD,18x19.2mm; JLCPCB Part Class: Extended Part; Datasheet: https://atta.szlcsc.com/upload/public/pdf/source/20241030/6A412B13087E1327DF6279F5735253CA.pdf; Supplier: LCSC
U175-U178 = ACS781LLRTR-100B-T: Current Range:100A Current Range:100A Supply Voltage:3V~3.6V Supply Voltage:3V~3.6V Sensitivity:13.2mV/A Operating Temperature:-40℃~+150℃ Operating Temperature:-40℃~+150℃; LCSC Part Name: 集成电路/电流霍尔芯片; Supplier Part: C459345; Manufacturer: ALLEGRO(美国埃戈罗); Supplier Footprint: PSOF-7; JLCPCB Part Class: Extended Part; Datasheet: https://atta.szlcsc.com/upload/public/pdf/source/20191122/C459345_94FAB92827FCBE2B10CEE0837564D725.pdf; Supplier: LCSC; Current Range: 100A; Supply Voltage: 3V~3.6V; Sensitivity: 13.2mV/A; Operating Temperature: -40℃~+150℃
U179 = TCA9548ARGER: Supplier Part: C555456; Manufacturer: TI(德州仪器); Supplier Footprint: VQFN-24-EP(4x4); JLCPCB Part Class: Extended Part; Datasheet: https://www.ti.com/cn/lit/gpn/tca9548a; Supplier: LCSC
U181-U183 = 74HC595BQ,115: Function:- Output Type:- Series:-; Supplier Part: C730243; Manufacturer: Nexperia(安世); Supplier Footprint: DHVQFN-16-EP(2.5x3.5); JLCPCB Part Class: Extended Part; Datasheet: https://atta.szlcsc.com/upload/public/pdf/source/20240724/C3A3241CA190230F407C83CEC4244600.pdf; Supplier: LCSC
U184-U199 = CS25FTE8R00027: Resistance: Tolerance:±1% Tolerance:±1% Power(Watts): Temperature Coefficient:±100ppm/℃ Temperature Coefficient:±100ppm/℃; LCSC Part Name: 8Ω ±1% 3W; Supplier Part: C304201; Manufacturer: Viking(光颉); Supplier Footprint: 1225; JLCPCB Part Class: Extended Part; Datasheet: https://atta.szlcsc.com/upload/public/pdf/source/20181023/C316195_01C52CFF62541A3F740CC971DFEB7970.pdf; Supplier: LCSC; Tolerance: ±1%; Temperature Coefficient: ±100ppm/℃
UART1 UART2 = 20021121-00006C4LF: Supplier: LCSC; Supplier Part: C178291; Manufacturer: Amphenol ICC; JLCPCB Part Class: Extended Part
USB1 = TYPE-C 16PIN 2MD(073): Connector Type:Type-C Standard:- Gender:Female Number of Ports:1 Number of Contacts:16P Mounting Style:卧贴 Current Rating - Power (Max):5A Operating Temperature Range:-25℃~+85℃ Operating Temperature Range:-25℃~+85℃; LCSC Part Name: Type-C 母 卧贴; Supplier Part: C2765186; Manufacturer: SHOU HAN(首韩); Supplier Footprint: SMD; JLCPCB Part Class: Extended Part; Datasheet: https://atta.szlcsc.com/upload/public/pdf/source/20211123/39B17C16241EAC15C5E277BDA434118E.pdf; Supplier: LCSC; Connector Type: Type-C; Gender: Female; Number of Ports: 1; Number of Contacts: 16P; Mounting Style: 卧贴; Current Rating - Power (Max): 5A; Operating Temperature Range: -25℃~+85℃
ZD1 = LBZX84C6V2LT1G: Diode Configuration:Independent Type Zener Voltage(Nom):6.2V Reverse Leakage Current (Ir):- Zener Voltage(Range):5.8V~6.6V Zener Voltage(Range):5.8V~6.6V Pd - Power Dissipation:225mW Impedance(Zzt):10Ω; Supplier Part: C12785; Manufacturer: LRC(乐山无线电); Supplier Footprint: SOT-23; JLCPCB Part Class: Extended Part; Datasheet: https://atta.szlcsc.com/upload/public/pdf/source/20190808/C411195_6E11CC7A657CB77FE82DAF3F76FAD179.pdf; Supplier: LCSC; Diode Configuration: Independent Type; Zener Voltage(Nom): 6.2V; Zener Voltage(Range): 5.8V~6.6V; Pd - Power Dissipation: 225mW; Impedance(Zzt): 10Ω

## Nets
+3V3A: C4.2 C391.2 C396.2 C397.1 C398.1 C399.2 C400.2 C401.2 C405.1 C406.1 L19.2 R194.2 R362.2 R363.2 RN1.5 RN1.6 RN1.7 RN1.8 RN2.5 RN2.6 RN2.7 RN2.8 TP1.1(P1) U175.1(VCC) U176.1(VCC) U177.1(VCC) U178.1(VCC) U179.21(VCC) U181.16(VCC) U182.16(VCC) U183.16(VCC)
+3V3B: C5.2 C392.2 C402.2 C407.2 D8.1(C) L20.2 R196.2 R337.2 R338.2 R339.2 R340.2 R346.1 R347.1 TP2.1(P1) U165.2(3V3) UART2.1
+3V3C: C394.2 C395.2 L21.2 R320.2 R348.2 R349.2 R350.2 R351.2 R352.2 R353.2 R354.2 R355.2 R356.2 R357.2 R358.2 R359.2 TP3.1(P1)
+5V: D28.2 UART1.1 UART1.3 UART1.5 USB1.2(VBUS) USB1.11(VBUS)
+5V_POW: BQ25896.1(VBUS) BQ25897.1(VBUS) BQ25898.1(VBUS) BQ25899.1(VBUS) C27.2 C247.2 C248.2 C367.2 C373.2 C379.2 C408.2 C409.2 CN19.1 D40.2(A) Q13.1(S) Q13.2(S) Q13.3(S) R374.2 TP4.1(P1) U162.1(ENA) U162.6(VDD) U162.8(ENB) U200.1(ENA) U200.6(VDD) U200.8(ENB) UART1.2 UART1.4 UART1.6 ZD1.3(K)
GND: BAT2.1(-) BAT3.1(-) BAT4.1(-) BAT5.1(-) BQ25896.2(PSEL) BQ25896.17(PGND) BQ25896.18(PGND) BQ25896.25(EPAD) BQ25897.2(PSEL) BQ25897.17(PGND) BQ25897.18(PGND) BQ25897.25(EPAD) BQ25898.2(PSEL) BQ25898.17(PGND) BQ25898.18(PGND) BQ25898.25(EPAD) BQ25899.2(PSEL) BQ25899.17(PGND) BQ25899.18(PGND) BQ25899.25(EPAD) C25.1 C26.1 C27.1 C28.2 C29.1 C247.1 C248.1 C254.1 C257.1 C365.1 C366.1 C367.1 C368.2 C369.1 C371.1 C372.1 C373.1 C374.2 C375.1 C377.1 C378.1 C379.1 C380.2 C381.1 C390.1 C391.1 C392.1 C393.1 C395.1 C396.1 C397.2 C398.2 C399.1 C400.1 C401.1 C402.1 C403.1 C405.2 C406.2 C407.1 C408.1 C409.1 CN19.2 CN20.2 CN21.2 CN22.2 CN23.2 D27.1 D28.1 D29.1 J1.2 J1.3 KEY2.1 KEY2.2 LED25.2(-) Q1.3(S) Q10.3(S) Q11.3(S) Q12.3(S) R24.2 R25.1 R26.1 R195.2 R197.2 R281.2 R282.1 R283.1 R286.2 R287.1 R288.1 R291.2 R292.1 R293.1 R321.2 R324.1 R326.1 R328.1 R330.1 R341.2 R342.2 R343.2 R344.2 R360.1 R361.1 R364.1 SW3.2 U9.1(GND3) U9.4(GND2) U9.5(GND2) U9.12(GND1) U9.13(GND1) U9.15(AGND) U9.17(AGND) U9.21(PAD) U162.3(GND) U165.1(GND) U165.40(GND) U165.41(GND) U175.2(GND) U176.2(GND) U177.2(GND) U178.2(GND) U179.9(GND) U179.18(A2) U179.22(A0) U179.23(A1) U179.25(EP) U181.8(GND) U181.17(GND) U182.8(GND) U182.17(GND) U183.8(GND) U183.17(GND) U200.3(GND) UART2.5 USB1.1(GND) USB1.12(GND) USB1.13(SHELL) USB1.14(SHELL)
VCCI: C254.2 C257.2 C390.2 C393.2 D7.1(K) D37.1(K) D38.1(K) D39.1(K) D40.1(K) R322.2 TP21.1(P1) U9.7(VIN2) U9.10(VIN1) U9.16(VCC) U9.19(VIN3)
VIN: J1.1 Q13.5(D) Q13.6(D) Q13.7(D) Q13.8(D) Q13.9(D)
B1: LED21.6(C) U182.1(Q1)
B2: LED22.6(C) U182.15(Q0)
B3: LED23.6(C) U182.2(Q2)
B4: LED24.6(C) U181.6(Q6)
BAT01: BQ25896.13(BAT) BQ25896.14(BAT) C26.2 Q2.1(S) Q2.2(S) Q2.3(S) Q3.2(S) R325.2 TP14.1(P1)
BAT01+: BAT5.2(+) CN23.1 Q2.5(D) Q2.6(D) Q2.7(D) Q2.8(D) Q2.9(D) Q3.1(G) R325.1 U178.5(IP+)
BAT02: BQ25897.13(BAT) BQ25897.14(BAT) C366.2 Q4.1(S) Q4.2(S) Q4.3(S) Q5.2(S) R327.2 TP15.1(P1)
BAT02+: BAT4.2(+) CN22.1 Q4.5(D) Q4.6(D) Q4.7(D) Q4.8(D) Q4.9(D) Q5.1(G) R327.1 U177.5(IP+)
BAT03: BQ25898.13(BAT) BQ25898.14(BAT) C372.2 Q6.1(S) Q6.2(S) Q6.3(S) Q7.2(S) R329.2 TP16.1(P1)
BAT03+: BAT3.2(+) CN21.1 Q6.5(D) Q6.6(D) Q6.7(D) Q6.8(D) Q6.9(D) Q7.1(G) R329.1 U176.5(IP+)
BAT04: BQ25899.13(BAT) BQ25899.14(BAT) C378.2 Q8.1(S) Q8.2(S) Q8.3(S) Q9.2(S) R331.2 TP17.1(P1)
BAT04+: BAT2.2(+) CN20.1 Q8.5(D) Q8.6(D) Q8.7(D) Q8.8(D) Q8.9(D) Q9.1(G) R331.1 U175.5(IP+)
BOOT: D8.2(A) KEY2.3 KEY2.4 R347.2 U165.27(IO0) UART2.6
BTST1: BQ25896.21(BTST) C24.1
BTST2: BQ25897.21(BTST) C364.1
BTST3: BQ25898.21(BTST) C370.1
BTST4: BQ25899.21(BTST) C376.1
CC1: R360.2 USB1.4(CC1)
CC2: R361.2 USB1.10(CC2)
CE1: BQ25896.9(CE) U183.1(Q1)
CE2: BQ25897.9(CE) U183.3(Q3)
CE3: BQ25898.9(CE) U183.6(Q6)
CE4: BQ25899.9(CE) U183.7(Q7)
EE: R322.1 U9.8(EN2) U9.9(EN1) U9.18(EN3)
FB1: C4.1 R194.1 R195.1 TP19.1(P1) U9.14(FB1)
FB2: C5.1 R196.1 R197.1 TP18.1(P1) U9.3(FB2)
FB3: C394.1 R320.1 R321.1 TP20.1(P1) U9.2(FB3)
G1: LED21.5(C) U181.2(Q2)
G2: LED22.5(C) U181.3(Q3)
G3: LED23.5(C) U182.3(Q3)
G4: LED24.5(C) U181.7(Q7)
G201: Q2.4(G) Q3.3(D) R324.2
G202: Q4.4(G) Q5.3(D) R326.2
G203: Q6.4(G) Q7.3(D) R328.2
G204: Q8.4(G) Q9.3(D) R330.2
GA: Q12.1(G) R341.1 R373.2 TP25.1(P1)
GB: Q11.1(G) R344.1 R372.2 TP24.1(P1)
GC: Q10.1(G) R343.1 R371.2 TP23.1(P1)
GD: Q1.1(G) R342.1 R370.2 TP22.1(P1)
GIN: Q13.4(G) R364.2 TP5.1(P1) ZD1.1(A)
I2C_SCL: R363.1 U165.5(IO5) U179.19(SCL)
I2C_SCL1: BQ25896.5(SCL) RN2.1 U179.8(SC3)
I2C_SCL2: BQ25897.5(SCL) RN2.2 U179.6(SC2)
I2C_SCL3: BQ25898.5(SCL) RN2.3 U179.4(SC1)
I2C_SCL4: BQ25899.5(SCL) RN2.4 U179.2(SC0)
I2C_SDA: R362.1 U165.4(IO4) U179.20(SDA)
I2C_SDA1: BQ25896.6(SDA) RN1.1 U179.7(SD3)
I2C_SDA2: BQ25897.6(SDA) RN1.2 U179.5(SD2)
I2C_SDA3: BQ25898.6(SDA) RN1.3 U179.3(SD1)
I2C_SDA4: BQ25899.6(SDA) RN1.4 U179.1(SD0)
ILIM1: BQ25896.10(ILIM) R26.2
ILIM2: BQ25897.10(ILIM) R283.2
ILIM3: BQ25898.10(ILIM) R288.2
ILIM4: BQ25899.10(ILIM) R293.2
INT1: BQ25896.7(INT) R337.1 U165.24(IO47)
INT2: BQ25897.7(INT) R338.1 U165.21(IO13)
INT3: BQ25898.7(INT) R339.1 U165.18(IO10)
INT4: BQ25899.7(INT) R340.1 U165.12(IO8)
IP1: U178.6(IP-) U196.2 U197.2 U198.2 U199.2
IP2: U177.6(IP-) U192.2 U193.2 U194.2 U195.2
IP3: U176.6(IP-) U188.2 U189.2 U190.2 U191.2
IP4: U175.6(IP-) U184.2 U185.2 U186.2 U187.2
LD01: U162.2(INA) U182.7(Q7)
LD02: U162.4(INB) U182.6(Q6)
LD03: U182.5(Q5) U200.2(INA)
LD04: U182.4(Q4) U200.4(INB)
LX1: L19.1 U9.11(LX1)
LX2: L20.1 U9.6(LX2)
LX3: L21.1 U9.20(LX3)
MR: U165.8(IO15) U181.10(MR#) U182.10(MR#) U183.10(MR#)
OE: U165.31(IO38) U181.13(OE#) U182.13(OE#) U183.13(OE#)
OTG1: BQ25896.8(OTG) U183.2(Q2)
OTG2: BQ25897.8(OTG) U183.4(Q4)
OTG3: BQ25898.8(OTG) U183.5(Q5)
OTG4: BQ25899.8(OTG) U183.15(Q0)
OUTA: R373.1 U162.7(OUTA)
OUTB: R372.1 U162.5(OUTB)
OUTC: R371.1 U200.7(OUTA)
OUTD: R370.1 U200.5(OUTB)
PG1: BQ25896.3(PG) U165.26(IO45)
PG2: BQ25897.3(PG) U165.23(IO21)
PG3: BQ25898.3(PG) U165.19(IO11)
PG4: BQ25899.3(PG) U165.15(IO3)
PMID1: BQ25896.23(PMID) C29.2
PMID2: BQ25897.23(PMID) C369.2
PMID3: BQ25898.23(PMID) C375.2
PMID4: BQ25899.23(PMID) C381.2
R1: LED21.4(C) U181.1(Q1)
R2: LED22.4(C) U181.5(Q5)
R3: LED23.4(C) U181.4(Q4)
R4: LED24.4(C) U181.15(Q0)
RCK: U165.10(IO17) U181.12(STCP) U182.12(STCP) U183.12(STCP)
REGN1: BQ25896.22(REGN) C28.1 R23.2
REGN2: BQ25897.22(REGN) C368.1 R280.2
REGN3: BQ25898.22(REGN) C374.1 R285.2
REGN4: BQ25899.22(REGN) C380.1 R290.2
RES1: Q12.2(D) U196.1 U197.1 U198.1 U199.1
RES2: Q11.2(D) U192.1 U193.1 U194.1 U195.1
RES3: Q10.2(D) U188.1 U189.1 U190.1 U191.1
RES4: Q1.2(D) U184.1 U185.1 U186.1 U187.1
RST: C403.2 R346.2 SW3.1 U165.3(EN) UART2.3
RST_I2C: U165.35(IO42) U179.24(RESET#)
RXD0: U165.36(RXD0) UART2.4
SCK: U165.9(IO16) U181.11(SHCP) U182.11(SHCP) U183.11(SHCP)
SER: U165.11(IO18) U181.14(DS)
SROUT1: U181.9(Q7S) U182.14(DS)
SROUT2: U182.9(Q7S) U183.14(DS)
STAT1: BQ25896.4(STAT) U165.25(IO48)
STAT2: BQ25897.4(STAT) U165.22(IO14)
STAT3: BQ25898.4(STAT) U165.20(IO12)
STAT4: BQ25899.4(STAT) U165.17(IO9)
SWT1: BQ25896.19(SW) BQ25896.20(SW) C24.2 L1.1
SWT2: BQ25897.19(SW) BQ25897.20(SW) C364.2 L2.1
SWT3: BQ25898.19(SW) BQ25898.20(SW) C370.2 L3.1
SWT4: BQ25899.19(SW) BQ25899.20(SW) C376.2 L4.1
TS1: BQ25896.11(TS) R23.1 R24.1 R25.2
TS2: BQ25897.11(TS) R280.1 R281.1 R282.2
TS3: BQ25898.11(TS) R285.1 R286.1 R287.2
TS4: BQ25899.11(TS) R290.1 R291.1 R292.2
TXD0: U165.37(TXD0) UART2.2
USB_D+: D29.2 U165.14(IO20) USB1.6(DP1) USB1.8(DP2)
USB_D-: D27.2 U165.13(IO19) USB1.5(DN2) USB1.7(DN1)
VOUTCRR1: TP6.1(P1) U165.39(IO1) U175.3(VOUT)
VOUTCRR2: TP7.1(P1) U165.38(IO2) U176.3(VOUT)
VOUTCRR3: TP8.1(P1) U165.6(IO6) U177.3(VOUT)
VOUTCRR4: TP9.1(P1) U165.7(IO7) U178.3(VOUT)
VSYS01: BQ25896.15(SYS) BQ25896.16(SYS) C25.2 D7.2(A) L1.2 TP11.1(P1)
VSYS02: BQ25897.15(SYS) BQ25897.16(SYS) C365.2 D37.2(A) L2.2 TP12.1(P1)
VSYS03: BQ25898.15(SYS) BQ25898.16(SYS) C371.2 D38.2(A) L3.2 TP10.1(P1)
VSYS04: BQ25899.15(SYS) BQ25899.16(SYS) C377.2 D39.2(A) L4.2 TP13.1(P1)
$1N223: LED21.3(A) R348.1
$1N229: LED21.2(A) R349.1
$1N230: LED21.1(A) R350.1
$1N396: LED22.3(A) R351.1
$1N402: LED22.2(A) R352.1
$1N403: LED22.1(A) R353.1
$1N737: LED23.3(A) R354.1
$1N738: LED23.2(A) R355.1
$1N740: LED23.1(A) R356.1
$1N741: LED24.1(A) R359.1
$1N742: LED24.2(A) R358.1
$1N747: LED24.3(A) R357.1
$1N84621: LED25.1(+) R374.1

Not connected (* = marked no-connect by the designer): BQ25896 12(QON)* 24(NC)*; BQ25897 12(QON)* 24(NC)*; BQ25898 12(QON)* 24(NC)*; BQ25899 12(QON)* 24(NC)*; U165 16(IO46)* 28(IO35)* 29(IO36)* 30(IO37)* 32(IO39)* 33(IO40)* 34(IO41)*; U175 4(NC)* 7(NC)*; U176 4(NC)* 7(NC)*; U177 4(NC)* 7(NC)*; U178 4(NC)* 7(NC)*; U179 10(SD4)* 11(SC4)* 12(SD5)* 13(SC5)* 14(SD6)* 15(SC6)* 16(SD7)* 17(SC7)*; U183 9(Q7S)*; USB1 3(SBU2)* 9(SBU1)*; ZD1 2(nc)*

## Notes on the sheet
- BATERRY REVERS POLARITY PROTECTION
- BATTERY CONNECTORS
- GATE DRIVER
- GPIO & I2C EXP
- CHANNEL03
- CHANNEL04
- SENSE
- CHANNEL01
- CHANNEL02
- Join to
  GND via
  pad
- Join to
  GND via
  pad
- Join to
  GND via
  pad
- Join to
  GND via
  pad
- FLAGS01
- FLAGS02
- FLAGS03
- FLAGS04
- CURRENT SENSE
- SWITCHES
- USB C CONNECTOR
- REVERSE POLARITY PROTECTION
- BUCK PSU
- JUMP PINS
- PROG PINS
- I2C
